# Altium schematic sheet IRComms.SchDoc
size A
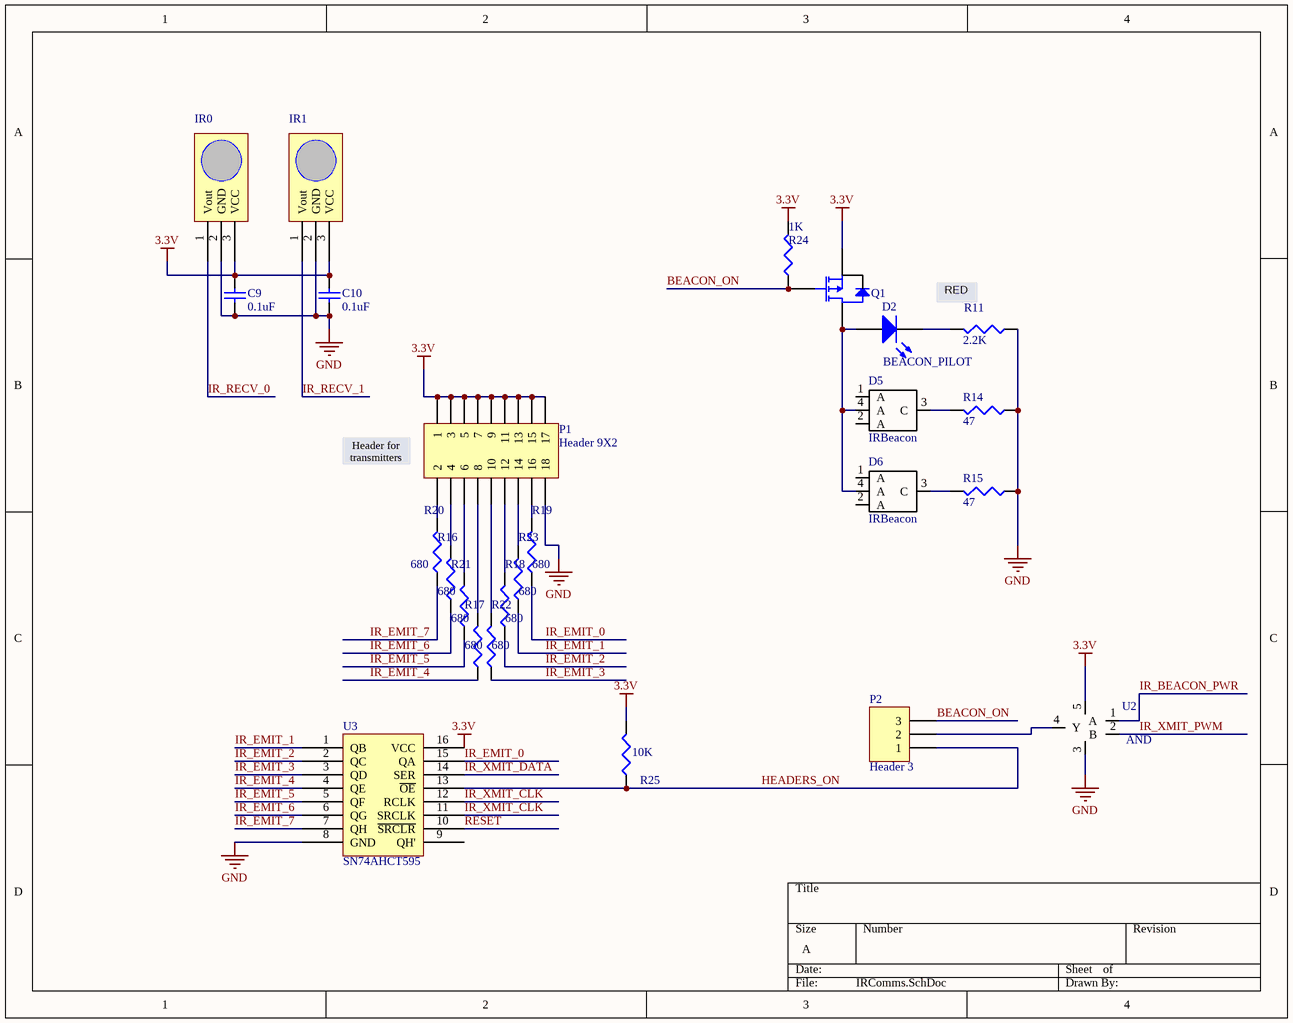
[diagram p0: IRComms.SchDoc]

## Parts
C9  value 0.1uF  [0402]  (hidden comment: Cap Semi)
C10  value 0.1uF  [0402]  (hidden comment: Cap Semi)
D2  BEACON_PILOT  [SurfaceMount(603)]
D5  IRBeacon  [IRBeacon]
D6  IRBeacon  [IRBeacon]
IR0  GP1UX31QS  [GP1UX31QS]  (value not drawn)
IR1  GP1UX31QS  [GP1UX31QS]  (value not drawn)
P1  Header 9X2  [HDR2X9]
P2  Header 3  [HDR1X3]
Q1  P-Mosfet  [SOT-23]  (value not drawn)
R11  value 2.2K  [J1-0603]  (hidden comment: Res3)
R14  value 47  [J1-0603]  (hidden comment: Res3)
R15  value 47  [J1-0603]  (hidden comment: Res3)
R16  value 680  [J1-0603]  (hidden comment: Res3)
R17  value 680  [J1-0603]  (hidden comment: Res3)
R18  value 680  [J1-0603]  (hidden comment: Res3)
R19  value 680  [J1-0603]  (hidden comment: Res3)
R20  value 680  [J1-0603]  (hidden comment: Res3)
R21  value 680  [J1-0603]  (hidden comment: Res3)
R22  value 680  [J1-0603]  (hidden comment: Res3)
R23  value 680  [J1-0603]  (hidden comment: Res3)
R24  value 1K  [J1-0603]  (hidden comment: Res3)
R25  value 10K  [J1-0603]  (hidden comment: Res3)
U2  AND  [SOT-23-5]
U3  SN74AHCT595  [TSSOP-16]

## Nets
3.3V: C9.2 C10.2 IR0.3(VCC) IR1.3(VCC) P1.1 P1.3 P1.5 P1.7 P1.9 P1.11 P1.13 P1.15 P1.17 Q1.2(S) R24.2 R25.2 U2.5(VCC) U3.16(VCC)
GND: C9.1 C10.1 IR0.2(GND) IR1.2(GND) P1.18 R11.1 R14.1 R15.1 U2.3(GND) U3.8(GND)
BEACON_ON: P2.3 Q1.1(G) R24.1
HEADERS_ON: P2.1 R25.1 U3.13(~{OE})
IR_BEACON_PWR: U2.1(A)
IR_EMIT_0: R19.1 U3.15(QA)
IR_EMIT_1: R23.1 U3.1(QB)
IR_EMIT_2: R18.1 U3.2(QC)
IR_EMIT_3: R22.1 U3.3(QD)
IR_EMIT_4: R17.1 U3.4(QE)
IR_EMIT_5: R21.1 U3.5(QF)
IR_EMIT_6: R16.1 U3.6(QG)
IR_EMIT_7: R20.1 U3.7(QH)
IR_RECV_0: IR0.1(Vout)
IR_RECV_1: IR1.1(Vout)
IR_XMIT_CLK: U3.11(SRCLK) U3.12(RCLK)
IR_XMIT_DATA: U3.14(SER)
IR_XMIT_PWM: U2.2(B)
RESET: U3.10(~{SRCLR})
NetD2_1: D2.1(A) D5.4(A) D6.4(A) Q1.3(D)
NetD2_2: D2.2(K) R11.2
NetD5_3: D5.3(C) R14.2
NetD6_3: D6.3(C) R15.2
NetP1_2: P1.2 R20.2
NetP1_4: P1.4 R16.2
NetP1_6: P1.6 R21.2
NetP1_8: P1.8 R17.2
NetP1_10: P1.10 R22.2
NetP1_12: P1.12 R18.2
NetP1_14: P1.14 R23.2
NetP1_16: P1.16 R19.2
NetP2_2: P2.2 U2.4(Y)

Not connected (* = marked no-connect by the designer): D5 1(A) 2(A); D6 1(A) 2(A); U3 9(QH')

## Notes on the sheet
- (near R11) RED
- (near P1) Header for transmitters

## Library data of the parts
C9 C10 = Cap Semi: Capacitor (Semiconductor SIM Model); Published: 8-Jun-2000; LatestRevisionDate: 29-May-2009; LatestRevisionNote: IPC-7351 Footprint Added.; PackageReference: C1206; Publisher: Altium Limited; PackageDescription: Chip Capacitor
D2 = LED
P1 = Header 9X2: Header, 9-Pin, Dual row; LatestRevisionDate: 17-Jul-2002; LatestRevisionNote: Re-released for DXP Platform.; Publisher: Altium Limited
P2 = Header 3: Header, 3-Pin; LatestRevisionDate: 17-Jul-2002; LatestRevisionNote: Re-released for DXP Platform.; Publisher: Altium Limited
R11 R14-R25 = Res3: Resistor; Published: 8-Jun-2000; LatestRevisionDate: 29-May-2009; LatestRevisionNote: IPC-7351 Footprint Added.; PackageReference: J1-0603; Publisher: Altium Limited; PackageDescription: Chip Resistor
U2 = AND_gate: 2 input AND gate
U3 = SN74AHCT595: shift register